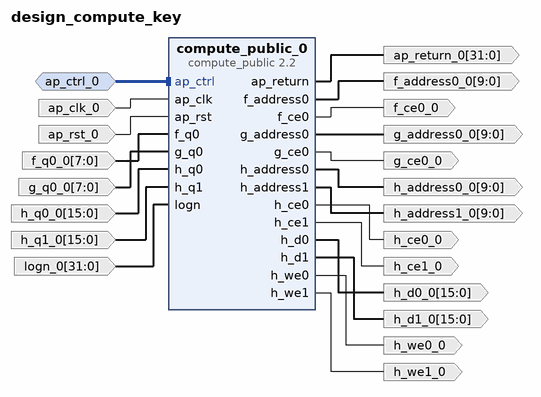
[diagram p0: block diagram of the top level]
# Vivado block design design_compute_key, xc7a35tcpg236-1, Vivado 2023.2
create_bd_design design_compute_key

create_bd_intf_port -mode Slave -vlnv xilinx.com:interface:acc_handshake_rtl:1.0 ap_ctrl_0
create_bd_port -dir I -type clk ap_clk_0
create_bd_port -dir O -from 31 -to 0 -type data ap_return_0
create_bd_port -dir I -type rst ap_rst_0
set_property -dict {CONFIG.POLARITY ACTIVE_HIGH} [get_bd_ports ap_rst_0]
create_bd_port -dir O -from 9 -to 0 -type data f_address0_0
create_bd_port -dir O f_ce0_0
create_bd_port -dir I -from 7 -to 0 -type data f_q0_0
create_bd_port -dir O -from 9 -to 0 -type data g_address0_0
create_bd_port -dir O g_ce0_0
create_bd_port -dir I -from 7 -to 0 -type data g_q0_0
create_bd_port -dir O -from 9 -to 0 -type data h_address0_0
create_bd_port -dir O -from 9 -to 0 -type data h_address1_0
create_bd_port -dir O h_ce0_0
create_bd_port -dir O h_ce1_0
create_bd_port -dir O -from 15 -to 0 -type data h_d0_0
create_bd_port -dir O -from 15 -to 0 -type data h_d1_0
create_bd_port -dir I -from 15 -to 0 -type data h_q0_0
create_bd_port -dir I -from 15 -to 0 -type data h_q1_0
create_bd_port -dir O h_we0_0
create_bd_port -dir O h_we1_0
create_bd_port -dir I -from 31 -to 0 -type data logn_0

create_bd_cell -type ip -vlnv Duy_Nguyen:Falcon_Keygen:compute_public:2.2 compute_public_0

# ---- connections ----

connect_bd_intf_net -intf_net ap_ctrl_0_1 [get_bd_intf_ports ap_ctrl_0] [get_bd_intf_pins compute_public_0/ap_ctrl]
connect_bd_net -net ap_clk_0_1 [get_bd_ports ap_clk_0] [get_bd_pins compute_public_0/ap_clk]
connect_bd_net -net ap_rst_0_1 [get_bd_ports ap_rst_0] [get_bd_pins compute_public_0/ap_rst]
connect_bd_net [get_bd_pins compute_public_0/ap_return] [get_bd_ports ap_return_0]
connect_bd_net [get_bd_pins compute_public_0/f_address0] [get_bd_ports f_address0_0]
connect_bd_net [get_bd_pins compute_public_0/f_ce0] [get_bd_ports f_ce0_0]
connect_bd_net [get_bd_pins compute_public_0/g_address0] [get_bd_ports g_address0_0]
connect_bd_net [get_bd_pins compute_public_0/g_ce0] [get_bd_ports g_ce0_0]
connect_bd_net [get_bd_pins compute_public_0/h_address0] [get_bd_ports h_address0_0]
connect_bd_net [get_bd_pins compute_public_0/h_address1] [get_bd_ports h_address1_0]
connect_bd_net [get_bd_pins compute_public_0/h_ce0] [get_bd_ports h_ce0_0]
connect_bd_net [get_bd_pins compute_public_0/h_ce1] [get_bd_ports h_ce1_0]
connect_bd_net [get_bd_pins compute_public_0/h_d0] [get_bd_ports h_d0_0]
connect_bd_net [get_bd_pins compute_public_0/h_d1] [get_bd_ports h_d1_0]
connect_bd_net [get_bd_pins compute_public_0/h_we0] [get_bd_ports h_we0_0]
connect_bd_net [get_bd_pins compute_public_0/h_we1] [get_bd_ports h_we1_0]
connect_bd_net -net f_q0_0_1 [get_bd_ports f_q0_0] [get_bd_pins compute_public_0/f_q0]
connect_bd_net -net g_q0_0_1 [get_bd_ports g_q0_0] [get_bd_pins compute_public_0/g_q0]
connect_bd_net -net h_q0_0_1 [get_bd_ports h_q0_0] [get_bd_pins compute_public_0/h_q0]
connect_bd_net -net h_q1_0_1 [get_bd_ports h_q1_0] [get_bd_pins compute_public_0/h_q1]
connect_bd_net -net logn_0_1 [get_bd_ports logn_0] [get_bd_pins compute_public_0/logn]

validate_bd_design
save_bd_design
